# EAGLE schematic BMS-Shield rev3 (EAGLE 8.1.0)
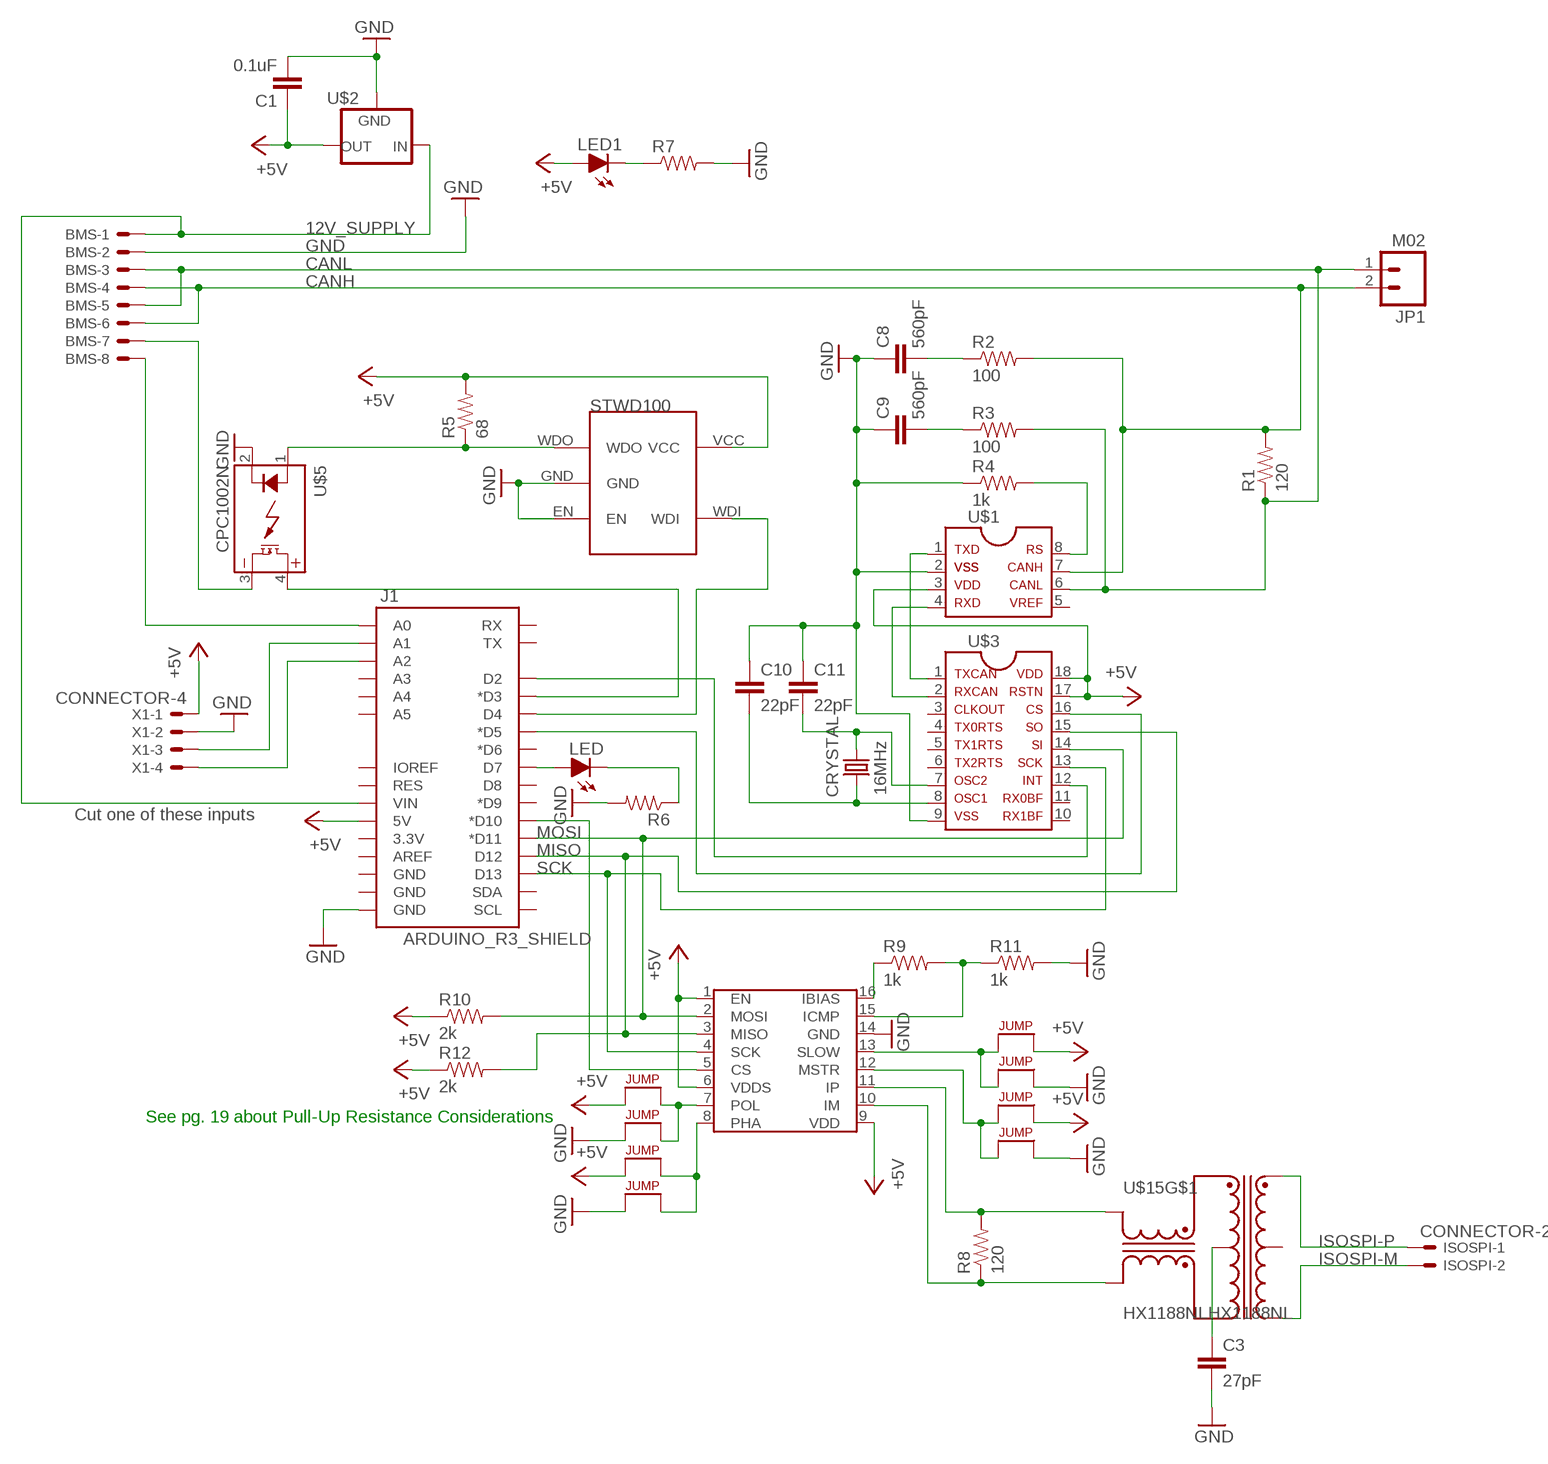
[diagram p0: schematic, sheet 1]

## Parts
BMS  MINIFIT_5566-8  [MINIFIT_5566-8]
C1  0.1uF  CAP0805  [0805]
C3  27pF  CAP0805  [0805]
C8  560pF  CAP0805  [0805]
C9  560pF  CAP0805  [0805]
C10  22pF  CAP0805  [0805]
C11  22pF  CAP0805  [0805]
CRYSTAL  16MHz  CRYSTALSMD  [HC49UP]
ISOSPI  CONNECTOR-2  [MINIFIT_5566-2]
J1  ARDUINO_R3_SHIELD  [UNO_R3_SHIELD]
JP1  M02  [1X02]
LED  LED-0805  [LED-805]
LED1  LED-0805  [LED-805]
R1  120  RESISTOR0805-RES  [0805]
R2  100  RESISTOR0805-RES  [0805]
R3  100  RESISTOR0805-RES  [0805]
R4  1k  RESISTOR0805-RES  [0805]
R5  68  RESISTOR0805-RES  [0805]
R6  RESISTOR0805-RES  [0805]
R7  RESISTOR0805-RES  [0805]
R8  120  RESISTOR0805-RES  [0805]
R9  1k  RESISTOR0805-RES  [0805]
R10  2k  RESISTOR0805-RES  [0805]
R11  1k  RESISTOR0805-RES  [0805]
R12  2k  RESISTOR0805-RES  [0805]
U$1  MCP2551  [SOIC-08]
U$2  5VREG_LM340-NLM340MPX-5.0/NOPB  [SOT223]
U$3  MCP2515SMD  [SOIC-18W]
U$4  STWD100  [SOT23-5]
U$5  CPC1002N  [SOP04]
U$6  LTC6820  [MSOP-16]
U$7  JUMPER  [0805]
U$8  JUMPER  [0805]
U$9  JUMPER  [0805]
U$10  JUMPER  [0805]
U$11  JUMPER  [0805]
U$12  JUMPER  [0805]
U$13  JUMPER  [0805]
U$14  JUMPER  [0805]
U$15  HX1188NLHX1188NL  [HX1188NL]
X1  CONNECTOR-4  [MINIFIT_5566-4]

## Nets
12V_SUPPLY: BMS.1 J1.VIN U$2.1(IN)
+5V: C1.1 J1.5V LED1.A R5.2 R10.1 R12.1 U$1.3 U$2.3(OUT) U$3.17 U$3.18 U$4.VCC U$6.1(EN) U$6.6(VDDS) U$6.9(VDD) U$7.1 U$10.1 U$11.2 U$13.2 X1.1
CANH: BMS.4 BMS.6 JP1.2 R1.2 R2.2 U$1.7
CANL: BMS.3 BMS.5 JP1.1 R1.1 R3.2 U$1.6
CS: J1.D5(*D5) U$3.16
GND: BMS.2 C1.2 C3.2 C8.1 C9.1 C10.1 C11.1 J1.GND@0(GND) R4.1 R6.2 R7.2 R11.2 U$1.2 U$2.2(GND) U$2.4(GND) U$3.9 U$4.EN U$4.GND U$5.2(CONTROL-) U$6.14(GND) U$8.1 U$9.1 U$12.2 U$14.2 X1.2
ISOSPI-M: ISOSPI.2 U$15.3(D-)
ISOSPI-P: ISOSPI.1 U$15.1(D+)
MISO: J1.D12 R12.2 U$3.15 U$6.3(MISO)
MOSI: J1.D11(*D11) R10.2 U$3.14 U$6.2(MOSI)
N$1: BMS.8 J1.A0
N$5: R5.1 U$4.WDO U$5.1(CONTROL+)
N$6: J1.D4 U$4.WDI
N$7: J1.D7 LED.A
N$8: BMS.7 U$5.3(DC-)
N$9: J1.D3(*D3) U$5.4(DC+)
N$10: J1.D2 U$3.12
N$11: C10.2 CRYSTAL.2 U$3.8
N$12: U$1.1 U$3.1
N$13: U$1.4 U$3.2
N$14: C8.2 R2.1
N$15: C11.2 CRYSTAL.1 U$3.7
N$16: R4.2 U$1.8
N$17: C9.2 R3.1
N$18: LED.C R6.1
N$19: J1.A1 X1.3
N$20: J1.A2 X1.4
N$21: J1.D10(*D10) U$6.5(CS)
N$22: LED1.C R7.1
N$23: U$6.7(POL) U$7.2 U$8.2
N$24: U$6.8(PHA) U$9.2 U$10.2
N$25: R9.1 U$6.16(IBIAS)
N$26: R9.2 R11.1 U$6.15(ICMP)
N$27: U$6.13(SLOW) U$11.1 U$12.1
N$28: U$6.12(MSTR) U$13.1 U$14.1
N$29: R8.1 U$6.10(IM) U$15.14(X-)
N$30: R8.2 U$6.11(IP) U$15.16(X+)
N$31: C3.1 U$15.15(CX)
SCK: J1.D13 U$3.13 U$6.4(SCK)
Unconnected: J1.3.3V J1.A3 J1.A4 J1.A5 J1.AREF J1.D6(*D6) J1.D8 J1.D9(*D9) J1.GND@1(GND) J1.GND@2(GND) J1.IOREF J1.RES J1.RX J1.SCL J1.SDA J1.TX U$1.5 U$3.3 U$3.4 U$3.5 U$3.6 U$3.10 U$3.11 U$15.2(CD) U$15.6(D+) U$15.7(CD) U$15.8(D-) U$15.9(X-) U$15.10(CX) U$15.11(X+)

## Notes on the sheet
- Cut one of these inputs ➡️
- See pg. 19 about Pull-Up Resistance Considerations

## Library data of the parts
BMS = HyTechDevices:MINIFIT_5566-8: Mini-Fit Junior connector 8 pole Source: http://www.molex.com; OC_FARNELL: unknown; OC_NEWARK: unknown
C1 C3 C8-C11 = HyTechDevices:CAP: Capacitor Standard 0603 ceramic capacitor, and 0.1" leaded capacitor.
CRYSTAL = SparkFun-FreqCtrl:CRYSTAL: Various standard crystals. Proven footprints.
ISOSPI = HyTechDevices:CONNECTOR-2: Mini-Fit Junior connector 2 pole Source: http://www.molex.com; OC_FARNELL: 1822072; OC_NEWARK: unknown
J1 = HyTechDevices:ARDUINO_R3_SHIELD: Shield form compatible with the Arduino Uno R3. Source: Sparkfun <https://github.com/sparkfun/SparkFun-Eagle-Libraries>
JP1 = HyTechDevices:M02: Standard 2-pin 0.1" header. NOTES ON THE VARIANTS LOCK and LOCK_LONGPADS... This footprint was designed to help hold the alignment of a through-hole component (i.e. 6-pin header) while soldering it into place. You may notice that each hole has been shifted either up or down by 0.005 of an inch from it's more standard position (which is a perfectly straight line). This slight alteration caused the pins (the squares in the middle) to touch the edges of the holes. Because they are alternating, it causes a "brace" to hold the component in place. 0.005 has proven to be the perfect amount of "off-center" position when using our standard breakaway headers. Although looks a little odd when you look at the bare footprint, once you have a header in there, the alteration is very hard to notice. Also,if you push a header all the way into place, it is covered up entirely on the bottom side. This idea of altering the position of holes to aid alignment will be further integrated into the Sparkfun Library for other footprints. It can help hold any component with 3 or more connection pins. Note: The Sparkfun version includes many other packages including surface mount that may be of future interest. Source: Sparkfun <https://github.com/sparkfun/SparkFun-Eagle-Libraries>
LED LED1 = HyTechDevices:LED: Light Emitting Diode (LED) Source: Dangerous Prototypes Eagle Library <https://github.com/DangerousPrototypes/Eagle_Part_Library>
R1-R12 = HyTechDevices:RESISTOR: Resistor Basic schematic elements and footprints for 0603, 1206, and PTH resistors.
U$1 = HyTechDevices:MCP2551: MCP2551 High-Speed CAN Transceiver Product Webpage <https://www.microchip.com/wwwproducts/en/MCP2551> Datasheet <http://ww1.microchip.com/downloads/en/DeviceDoc/21667f.pdf> This device is outdated It is replaced by MCP2561. Comparison Page <https://www.microchip.com/wwwproducts/ProductCompare/MCP2551/MCP2561> Product Webpage <https://www.microchip.com/wwwproducts/en/MCP2561> Datasheet <http://ww1.microchip.com/downloads/en/DeviceDoc/20005167C.pdf>
U$2 = HyTechDevices:5VREG_LM340-N: Voltage Regulator 5v linear voltage regulator Datasheet <http://www.mouser.com/ProductDetail/Texas-Instruments/LM340MPX-50-NOPB/?qs=X1J7HmVL2ZGZwtTFRQ9ItA%3D%3D> MAX current out: 1.5A MAX voltage in: 35V
U$3 = HyTechDevices:MCP2515: MCP2515 CAN Controller with SPI Interface Datasheet <http://ww1.microchip.com/downloads/en/DeviceDoc/21801G.pdf>
U$4 = HyTechDevices:STWD100: STWD100 Watchdog timer
U$5 = HyTechDevices:CPC1002N: IXYS Solid State Relay .7A
U$6 = HyTechDevices:LTC6820
U$7-U$14 = HyTechDevices:JUMPER: Jumper for changing operation of a device
U$15 = HyTechDevices:HX1188NL: Pulse Electronics HX1188NL Transformer
X1 = HyTechDevices:CONNECTOR-4: Mini-Fit Junior connector 4 pole Source: http://www.molex.com; OC_FARNELL: unknown; OC_NEWARK: unknown